# Altium project Group 2 Assignment 2.PrjPcb
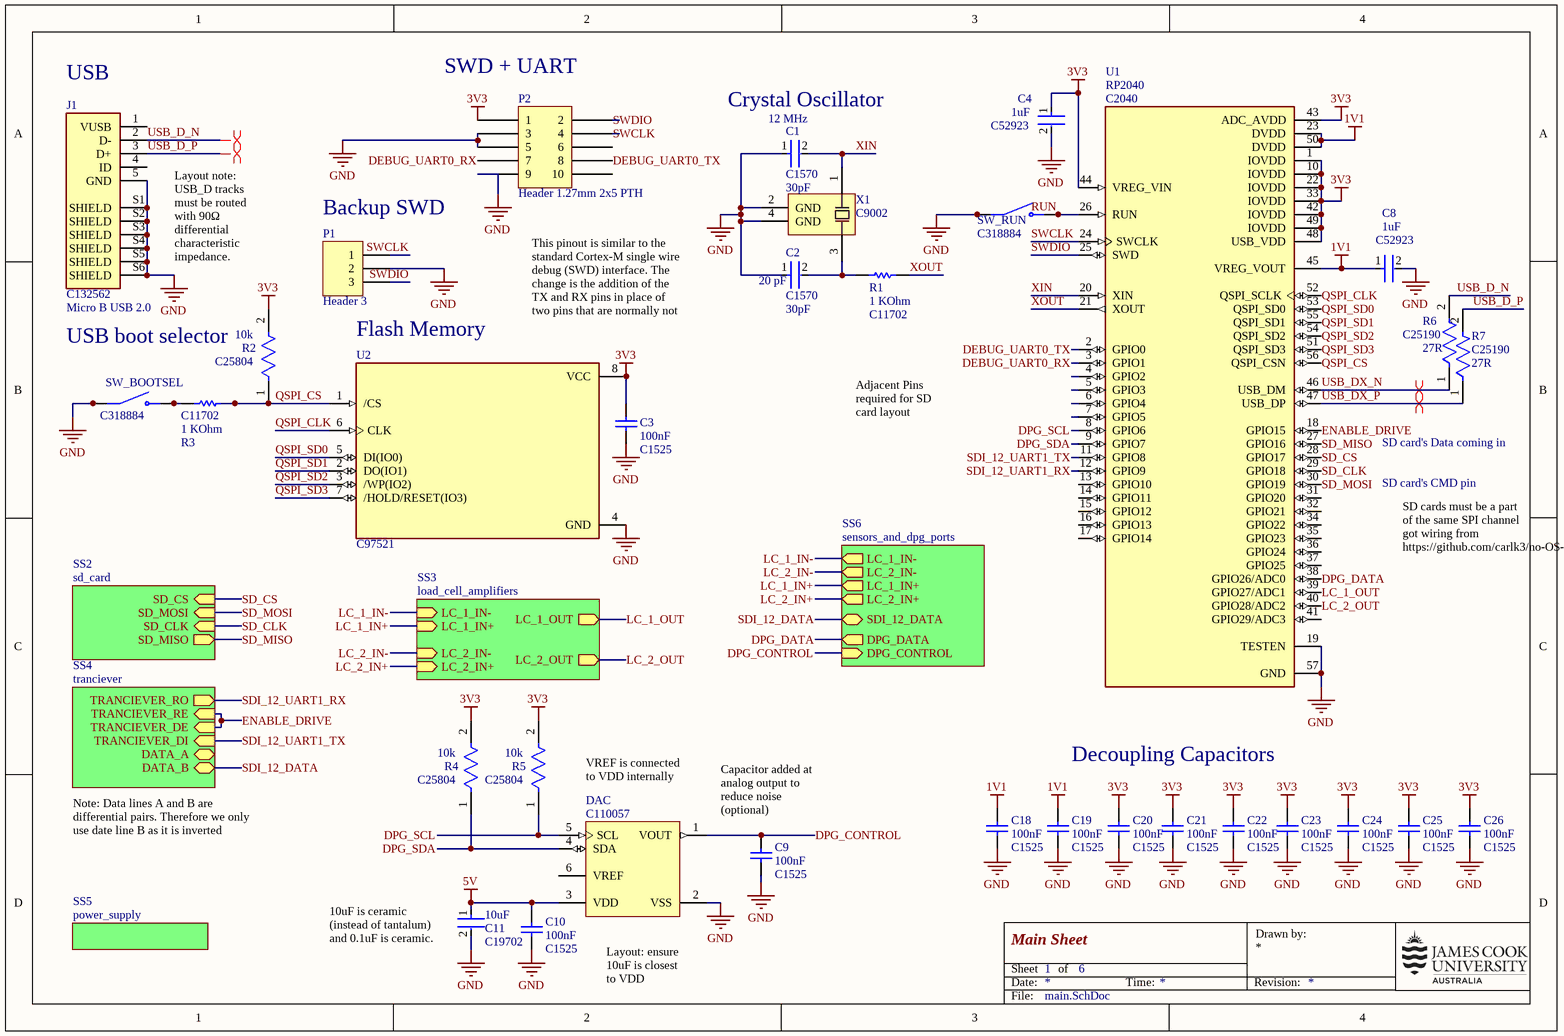
[diagram p0: main.SchDoc]
6 sheets, 73 parts. Net scope: hierarchical (ports join the sheet entries above them; power ports are global).
Board file: PCB.PcbDoc
Sheets:
  main.SchDoc
    SS2 = sd_card.SchDoc
    SS3 = load_cell_amplifiers.SchDoc
    SS4 = tranciever.SchDoc
    SS5 = power_supply.SchDoc
    SS6 = sensors_and_dpg_ports.SchDoc

## Sheet main.SchDoc: Main Sheet
size A4; SheetNumber: 1; SheetTotal: 6

### Parts
C1  JLCPCB Part: C1570  Capacitance: 30pF  [FP-0402-L_1_0_1-W_0_5_0_1-IPC_B]  (hidden comment: 0402CG300J500NT)
C2  JLCPCB Part: C1570  Capacitance: 30pF  [FP-0402-L_1_0_1-W_0_5_0_1-IPC_B]  (hidden comment: 0402CG300J500NT)
C3  JLCPCB Part: C1525  Capacitance: 100nF  [CAPC1050X55X23NL05T13]  (hidden comment: CL05B104KO5NNNC)
C4  Capacitance: 1uF  JLCPCB Part: C52923  [FP-CL542-IPC_B]  (hidden comment: CL05A105KA5NQNC)
C8  Capacitance: 1uF  JLCPCB Part: C52923  [FP-CL542-IPC_B]  (hidden comment: CL05A105KA5NQNC)
C9  JLCPCB Part: C1525  Capacitance: 100nF  [CAPC1050X55X23NL05T13]  (hidden comment: CL05B104KO5NNNC)
C10  JLCPCB Part: C1525  Capacitance: 100nF  [CAPC1050X55X23NL05T13]  (hidden comment: CL05B104KO5NNNC)
C11  JLCPCB Part: C19702  Capacitance: 10uF  [FP-CL10-IPC_B]  (hidden comment: CL10A106KP8NNNC)
C18  JLCPCB Part: C1525  Capacitance: 100nF  [CAPC1050X55X23NL05T13]  (hidden comment: CL05B104KO5NNNC)
C19  JLCPCB Part: C1525  Capacitance: 100nF  [CAPC1050X55X23NL05T13]  (hidden comment: CL05B104KO5NNNC)
C20  JLCPCB Part: C1525  Capacitance: 100nF  [CAPC1050X55X23NL05T13]  (hidden comment: CL05B104KO5NNNC)
C21  JLCPCB Part: C1525  Capacitance: 100nF  [CAPC1050X55X23NL05T13]  (hidden comment: CL05B104KO5NNNC)
C22  JLCPCB Part: C1525  Capacitance: 100nF  [CAPC1050X55X23NL05T13]  (hidden comment: CL05B104KO5NNNC)
C23  JLCPCB Part: C1525  Capacitance: 100nF  [CAPC1050X55X23NL05T13]  (hidden comment: CL05B104KO5NNNC)
C24  JLCPCB Part: C1525  Capacitance: 100nF  [CAPC1050X55X23NL05T13]  (hidden comment: CL05B104KO5NNNC)
C25  JLCPCB Part: C1525  Capacitance: 100nF  [CAPC1050X55X23NL05T13]  (hidden comment: CL05B104KO5NNNC)
C26  JLCPCB Part: C1525  Capacitance: 100nF  [CAPC1050X55X23NL05T13]  (hidden comment: CL05B104KO5NNNC)
DAC  JLCPCB Part: C110057  [SOT-23-CH6_M]  (hidden comment: MCP4716A0T-E/CH)
J1  Micro B USB 2.0  JLCPCB Part: C132562  [FCI_10118193-0001LF]
P1  Header 3  [HDR1X3]
P2  Header 1.27mm 2x5 PTH  [Header 1.27mm 2x5 PTH]
R1  JLCPCB Part: C11702  Resistance: 1 KOhm  [RESC1005X40X25NL05T05]  (hidden comment: 0402WGF1001TCE)
R2  JLCPCB Part: C25804  Resistance: 10k  [FP-CRCW0603-e3-IPC_B]  (hidden comment: 0603WAF1002T5E)
R3  JLCPCB Part: C11702  Resistance: 1 KOhm  [RESC1005X40X25NL05T05]  (hidden comment: 0402WGF1001TCE)
R4  JLCPCB Part: C25804  Resistance: 10k  [FP-CRCW0603-e3-IPC_B]  (hidden comment: 0603WAF1002T5E)
R5  JLCPCB Part: C25804  Resistance: 10k  [FP-CRCW0603-e3-IPC_B]  (hidden comment: 0603WAF1002T5E)
R6  JLCPCB Part: C25190  Resistance: 27R  [FP-CRCW0603-e3-IPC_B]  (hidden comment: 0603WAF270JT5E)
R7  JLCPCB Part: C25190  Resistance: 27R  [FP-CRCW0603-e3-IPC_B]  (hidden comment: 0603WAF270JT5E)
SW_BOOTSEL  JLCPCB Part: C318884  [SW_TS-1187A-B-A-B]  (hidden comment: TS-1187A-B-A-B)
SW_RUN  JLCPCB Part: C318884  [SW_TS-1187A-B-A-B]  (hidden comment: TS-1187A-B-A-B)
U1  RP2040  JLCPCB Part: C2040  [QFN40P700X700X90-57N]
U2  JLCPCB Part: C97521  [SOIC127P790X216-8N]  (hidden comment: W25Q128JVSIQ)
X1  Frequency: 12 MHz  JLCPCB Part: C9002  Load capacitance: 20 pF  [X322512MSB4SI-Footprint-1]  (hidden comment: X322512MSB4SI)

### Sub-sheets
SS2 = sd_card: SD_CS (in), SD_CLK (in), SD_MOSI (in), SD_MISO (out)
SS3 = load_cell_amplifiers: LC_1_IN- (in), LC_1_IN+ (in), LC_1_OUT (out), LC_2_IN- (in), LC_2_IN+ (in), LC_2_OUT (out)
SS4 = tranciever: TRANCIEVER_RO (out), TRANCIEVER_RE (in), TRANCIEVER_DE (in), TRANCIEVER_DI (in), DATA_A (bidir), DATA_B (bidir)
SS5 = power_supply: no entries
SS6 = sensors_and_dpg_ports: LC_1_IN- (out), LC_2_IN- (out), LC_2_IN+ (out), LC_1_IN+ (out), SDI_12_DATA (bidir), DPG_CONTROL (in), DPG_DATA (out)

### Nets
1V1: C8.1 C18.2 C19.2 U1.23(DVDD) U1.45(VREG_VOUT) U1.50(DVDD)
3V3: C3.2 C4.1 C20.2 C21.2 C22.2 C23.2 C24.2 C25.2 C26.2 P2.1 R2.2 R4.2 R5.2 U1.1(IOVDD) U1.10(IOVDD) U1.22(IOVDD) U1.33(IOVDD) U1.42(IOVDD) U1.43(ADC_AVDD) U1.44(VREG_VIN) U1.48(USB_VDD) U1.49(IOVDD) U2.8(VCC)
5V: C10.2 C11.1 DAC.3(VDD)
GND: C1.1 C2.1 C3.1 C4.2 C8.2 C9.1 C10.1 C11.2 C18.1 C19.1 C20.1 C21.1 C22.1 C23.1 C24.1 C25.1 C26.1 DAC.2(VSS) J1.5(GND) J1.S1(SHIELD) J1.S2(SHIELD) J1.S3(SHIELD) J1.S4(SHIELD) J1.S5(SHIELD) J1.S6(SHIELD) P1.2 P2.3 P2.5 P2.9 SW_BOOTSEL.A(COM) SW_BOOTSEL.B(COM) SW_RUN.A(COM) SW_RUN.B(COM) U1.19(TESTEN) U1.57(GND) U2.4(GND) X1.2(GND) X1.4(GND)
DEBUG_UART0_RX: P2.7 U1.3(GPIO1)
DEBUG_UART0_TX: P2.8 U1.2(GPIO0)
DPG_CONTROL: C9.2 DAC.1(VOUT) ; sheet SS6/DPG_CONTROL
DPG_DATA: U1.38(GPIO26/ADC0) ; sheet SS6/DPG_DATA
DPG_SCL: DAC.5(SCL) R5.1 U1.8(GPIO6)
DPG_SDA: DAC.4(SDA) R4.1 U1.9(GPIO7)
ENABLE_DRIVE: U1.18(GPIO15) ; sheet SS4/TRANCIEVER_RE, sheet SS4/TRANCIEVER_DE
LC_1_IN+: sheet SS3/LC_1_IN+, sheet SS6/LC_1_IN+
LC_1_IN-: sheet SS3/LC_1_IN-, sheet SS6/LC_1_IN-
LC_1_OUT: U1.39(GPIO27/ADC1) ; sheet SS3/LC_1_OUT
LC_2_IN+: sheet SS3/LC_2_IN+, sheet SS6/LC_2_IN+
LC_2_IN-: sheet SS3/LC_2_IN-, sheet SS6/LC_2_IN-
LC_2_OUT: U1.40(GPIO28/ADC2) ; sheet SS3/LC_2_OUT
QSPI_CLK: U1.52(QSPI_SCLK) U2.6(CLK)
QSPI_CS: R2.1 R3.2 U1.56(QSPI_CSN) U2.1(/CS)
QSPI_SD0: U1.53(QSPI_SD0) U2.5(DI(IO0))
QSPI_SD1: U1.55(QSPI_SD1) U2.2(DO(IO1))
QSPI_SD2: U1.54(QSPI_SD2) U2.3(/WP(IO2))
QSPI_SD3: U1.51(QSPI_SD3) U2.7(/HOLD/RESET(IO3))
RUN: SW_RUN.C(NO) SW_RUN.D(NO) U1.26(RUN)
SD_CLK: U1.29(GPIO18) ; sheet SS2/SD_CLK
SD_CS: U1.28(GPIO17) ; sheet SS2/SD_CS
SD_MISO: U1.27(GPIO16) ; sheet SS2/SD_MISO
SD_MOSI: U1.30(GPIO19) ; sheet SS2/SD_MOSI
SDI_12_DATA: sheet SS4/DATA_B, sheet SS6/SDI_12_DATA
SDI_12_UART1_RX: U1.12(GPIO9) ; sheet SS4/TRANCIEVER_RO
SDI_12_UART1_TX: U1.11(GPIO8) ; sheet SS4/TRANCIEVER_DI
SWCLK: P1.1 P2.4 U1.24(SWCLK)
SWDIO: P1.3 P2.2 U1.25(SWD)
USB_D_N: J1.2(D-) R6.2
USB_D_P: J1.3(D+) R7.2
USB_DX_N: R6.1 U1.46(USB_DM)
USB_DX_P: R7.1 U1.47(USB_DP)
XIN: C1.2 U1.20(XIN) X1.1(OSC1)
XOUT: R1.2 U1.21(XOUT)
NetC2_2: C2.2 R1.1 X1.3(OSC2)
NetR3_1: R3.1 SW_BOOTSEL.C(NO) SW_BOOTSEL.D(NO)

Not connected (* = marked no-connect by the designer): DAC 6(VREF); J1 1(VUSB) 4(ID); P2 6 10; U1 4(GPIO2) 5(GPIO3) 6(GPIO4) 7(GPIO5) 13(GPIO10) 14(GPIO11) 15(GPIO12) 16(GPIO13) 17(GPIO14) 31(GPIO20) 32(GPIO21) 34(GPIO22) 35(GPIO23) 36(GPIO24) 37(GPIO25) 41(GPIO29/ADC3)

### Layout directives
differential pair: USB_D_N, USB_D_P, USB_DX_N, USB_DX_P

### Notes on the sheet
- (near J1) USB
- (near P2) SWD + UART
- (near C1) Crystal Oscillator
- (near P1) Backup SWD
- Layout note: USB_D tracks must be routed with 90Ω differential characteristic impedance.
- This pinout is similar to the standard Cortex-M single wire debug (SWD) interface. The change is the addition of the TX and RX pins in place of two pins that are normally not connected.
- (near R2) USB boot selector
- Flash Memory
- Adjacent Pins required for SD card layout
- SD card's Data coming in
- SD card's CMD pin
- SD cards must be a part of the same SPI channel
  got wiring from https://github.com/carlk3/no-OS-FatFS-SD-SPI-RPi-Pico
- VREF is connected to VDD internally
- Decoupling Capacitors
- Note: Data lines A and B are differential pairs. Therefore we only use date line B as it is inverted
- Capacitor added at analog output to reduce noise (optional)
- (near C11) 10uF is ceramic (instead of tantalum) and 0.1uF is ceramic.
- (near DAC) Layout: ensure 10uF is closest to VDD
- Date:
- Sheet
- of
- Time:
- Revision:
- Drawn by:
- File:

### Library data of the parts
C1 C2 = CMP-006-0002-1: General Purpose Ceramic Capacitor, 0402, 30pF, 5%, C0G, 30ppm/°C, 50V; Insulation Resistance: 100GR; Height: 0.5mm; Dielectric: C0G; Max Operating Temperature: 125°C; Contact Plating: Tin; Thickness: 0.022inch; Lead Free: Lead Free; Case Code (Metric): 1005; Min Operating Temperature: -55°C; Termination: SMD/SMT; Number of Pins: 2; REACH SVHC: No SVHC; Length: 1mm; Tolerance: 5%; Depth: 0.5mm; Voltage: 50V; Width: 0.5mm; Radiation Hardening: No; Voltage Rating: 50V; Case Code (Imperial): 0402; Package Quantity: 1; Construction: Flat; Case/Package: 0402; Temperature Coefficient: 30ppm/°C; Mount: Surface Mount; Packaging: Tape and Reel; RoHS Compliant: Yes; Voltage Rating (DC): 50V; Series: -
C3 C9 C10 C18-C26 = CMP-00007-3: Chip Capacitor, 100 nF, +/- 10%, 16 V, -55 to 125 degC, 0402 (1005 Metric), RoHS, Tape and Reel; Manufacturer: Samsung Electro-Mechanics; Rated Voltage: 16V; Dielectric: X7R; Manufacturer URL: http://www.samsungsem.com/global/index.jsp; Datasheet Version: Nov-10; Case Size/Dimension: 0402; Tolerance (%): ±10%; Datasheet URL: https://datasheet.ciiva.com/29198/458718-da-01-en-vs-kondensator-0402-29198423.pdf
C4 C8 = CMP-00005-3: Cap Ceramic 1uF 25V X5R ±10% SMD 0402 +85°C Paper T/R; Height: 0.5mm; Thickness: 0.022inch; Radiation Hardening: No; Dielectric: X5R; Lead Free: Lead Free; Min Operating Temperature: -55°C; Mount: Surface Mount; Package Quantity: 10000; Case Code (Imperial): 0402; Voltage Rating: 25V; Case Code (Metric): 1005; Length: 1mm; Max Operating Temperature: 85°C; Case/Package: 0402; Tolerance: 10%; Packaging: Tape and Reel; Material: Ceramic; Depth: 0.5mm; Width: 0.02inch
C11 = CMP-00006-4: Cap Ceramic 10uF 10V X5R ±10% Pad SMD 0603 +85°C T/R; Case Code (Metric): 1608; Packaging: Tape and Reel; Case/Package: 0603; Voltage Rating: 10V; Mount: Surface Mount; Max Operating Temperature: 85°C; Width: 0.031inch; Length: 0.063inch; Case Code (Imperial): 0603; Thickness: 0.041inch; Tolerance: 10%; Min Operating Temperature: -55°C
DAC = CMP-0188-01210-1: 10-Bit Voltage Output Digital-to-Analog Converter with EEPROM and I2C Interface, 6-Pin SOT-23, Extended Temperature, Tape and Reel; Code_IPC: SOT26A-6; ComponentLink2Description: Datasheet; DatasheetVersion: revB, Sep-2011; PackageDescription: 6-Lead Plastic Small Outline Transistor (CH) [SOT-23]; ComponentLink2URL: http://ww1.microchip.com/downloads/en/DeviceDoc/22272B.pdf; ComponentLink1URL: http://www.microchip.com/; PackageReference: SOT-23-CH6; ComponentLink1Description: Manufacturer URL; ComponentLink3URL: http://www.microchip.com/stellent/groups/techpub_sg/documents/packagingspec/en012702.pdf; ComponentLink3Description: Package Specification; PackageVersion: revBB, Aug-2009
J1 = CMP-045-000000-8: USB - micro B USB 2.0 Receptacle Connector 5 Position Surface Mount, Right Angle; Through Hole; MF: Amphenol ICC; MP: 10118193-0001LF; Component Type: Standard; Design Item ID: 10118193-0001LF; Pin Count: 11; Package: None; Source: SnapEDAsch.SchLib; SnapEDA_Link: https://www.snapeda.com/parts/10118193-0001LF/Amphenol%20FCI/view-part/2758989/?ref=snap
P1 = CMP-002-00117-1: Header, 3-Pin; Signal Integrity: Connector; Design Item ID: Header 3; LatestRevisionDate: 17-Jul-2002; Publisher: Altium Limited; Component Type: Standard; Pin Count: 3; Source: Miscellaneous Connectors.SchLib; LatestRevisionNote: Re-released for DXP Platform.
P2 = CMP-005-0002-2: Header 1.27mm pitch, 2x5, PTH through hole; Pins: 10; element14 Item: 1577743; Design Item ID: Header 1.27mm 2x5 PTH; Source: JCULibrary.SchLib; Component Type: Standard
R1 R3 = CMP-009-0000-2: Chip Resistor, 1 KOhm, +/- 1%, 100 mW, -55 to 155 degC, 0402 (1005 Metric), RoHS, Tape and Reel; Manufacturer: Basic Passives; Voltage Rating: 50 V; Case\/Package: 0402; Power Rating: 100 mW; PackageDescription: 2-Pin Surface Mount Device, Body 1 x 0.5 mm; Max Operating Temperature: 155 degC; PackageReference: 0402; Mount: Surface Mount; Package Quantity: 10000; Pins: 2; Mounting Technology: Surface Mount; Tolerance: 1%; Width: 0.5 mm; Min Operating Temperature: -55 degC; Height: 0.35 mm; Packaging: Tape and Reel; Case Code (Metric): 1005; Case Code (Imperial): 0402; Radiation Hardening: No; PartNumber: 0402WGF1001TCE; Length: 1 mm; REACH SVHC: Yes; RoHSCompliant: true
R2 R4 R5 = CMP-009-0009-1: RES Thick Film, 10kΩ, 1%, 0.1W, 100ppm/°C, 0603; Voltage Rating: 75V; Power Rating: 100mW; Composition: Thick Film; Military Standard: Not; Temperature Coefficient: 100ppm/°C; Length: 1.55mm; Tolerance: 1%; Lead Free: Lead Free; Max Operating Temperature: 155°C; Number of Pins: 2; Width: 0.85mm; Termination: SMD/SMT; Packaging: Tape and Reel; Weight: 7.1E-05oz; Radiation Hardening: No; Voltage Rating (DC): 75V; Height: 0.45mm; Min Operating Temperature: -55°C; Mount: Surface Mount; Contact Plating: Tin; Case Code (Metric): 1608; Case Code (Imperial): 0603; Depth: 0.85mm; Case/Package: 0603; Package Quantity: 5000
R6 R7 = CMP-00004-5: RES Thick Film, 27Ω, 1%, 0.1W, 200ppm/°C, 0603; Voltage Rating (DC): 75V; Temperature Coefficient: 100ppm/°C; Power Rating: 100mW; Height: 0.45mm; Contact Plating: Tin; Radiation Hardening: No; Case/Package: 0603; Mount: Surface Mount; Max Operating Temperature: 155°C; Packaging: Tape and Reel; Length: 1.55mm; Tolerance: 1%; Package Quantity: 5000; Termination: SMD/SMT; Number of Pins: 2; Depth: 0.85mm; Case Code (Metric): 1608; Case Code (Imperial): 0603; Width: 0.85mm; Military Standard: Not; Min Operating Temperature: -55°C; Lead Free: Lead Free; Composition: Thick Film; Weight: 7.1E-05oz; Voltage Rating: 75V
SW_BOOTSEL SW_RUN = CMP-051-000000-5: SPST 50mA @ 12VDC Top Actuated Round Button 160gf SMD Tactile Switches RoHS; Value: *; Pin Count: 4; MP: TS-1187A-B-A-B; Price: None; Availability: Unavailable; Design Item ID: TS-1187A-B-A-B; Package: None; Component Type: Standard; Source: TS-1187A-B-A-B.SchLib
U1 = CMP-043-000000-5: ARM Cortex-M0+ MCU 32-Bit Microcontroller for Raspberry Pi Pico; Package: None; Price: None; Availability: Available; Design Item ID: RP2040; Component Type: Standard; Pin Count: 57; Source: RP2040.SchLib; Value: *; MP: RP2040
U2 = CMP-031-00006-4: FLASH - NOR Memory IC 128Mb (16M x 8) SPI - Quad I/O, QPI, DTR 133 MHz 8-SOIC; MF: Winbond Electronics; Pin Count: 8; Check_prices: https://www.snapeda.com/parts/W25Q128JVSIQ/Winbond+Electronics/view-part/?ref=eda; Package: SOIC-8 Winbond; MP: W25Q128JVSIQ; Component Type: Standard; Source: W25Q128JVSIQ.SchLib; Design Item ID: W25Q128JVSIQ; Purchase-URL: https://pricing.snapeda.com/search/part/W25Q128JVSIQ/?ref=eda; Price: None; Availability: In Stock; SnapEDA_Link: https://www.snapeda.com/parts/W25Q128JVSIQ/Winbond+Electronics/view-part/?ref=snap; Value: *
X1 = CMP-00002-4: 12MHz SMD Crystal Resonator 20pF ±10ppm ±30ppm -40℃~+85℃ SMD3225-4P  Crystals ROHS Yangxing Tech; Max ESR: 80 Ω

## Sheet sd_card.SchDoc: SD Card Reader Header
size A4; DrawnBy: Hunter Kruger-Ilingworth; SheetNumber: 2; SheetTotal: 6
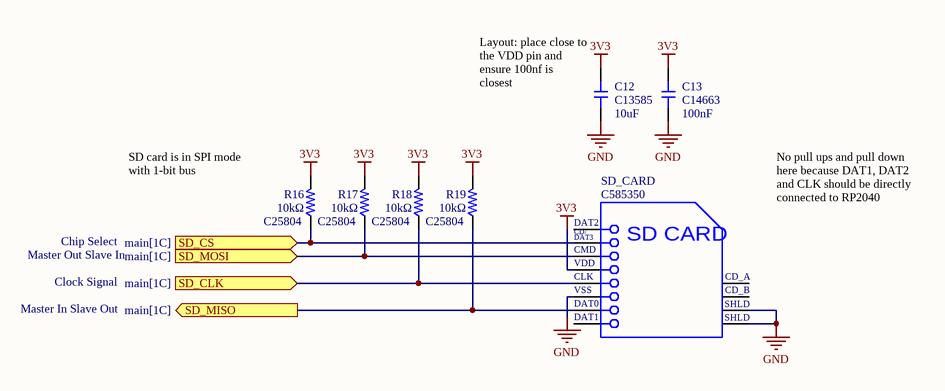
[diagram p1: sd_card.SchDoc]

### Parts
C12  Capacitance: 10uF  JLCPCB Part: C13585  [CAP-1206]  (hidden comment: CL31A106KBHNNNE)
C13  Capacitance: 100nF  JLCPCB Part: C14663  [CAP-0603]  (hidden comment: CC0603KRX7R9BB104)
R16  Resistance: 10kΩ  JLCPCB Part: C25804  [RES-0603]  (hidden comment: 0603WAF1002T5E)
R17  Resistance: 10kΩ  JLCPCB Part: C25804  [RES-0603]  (hidden comment: 0603WAF1002T5E)
R18  Resistance: 10kΩ  JLCPCB Part: C25804  [RES-0603]  (hidden comment: 0603WAF1002T5E)
R19  Resistance: 10kΩ  JLCPCB Part: C25804  [RES-0603]  (hidden comment: 0603WAF1002T5E)
SD_CARD  JLCPCB Part: C585350  [MOLX-104031-0811_V]  (hidden comment: 104031-0811)

### Ports
SD_CLK (in, see main[1C]), SD_CS (in, see main[1C]), SD_MISO (out, see main[1C]), SD_MOSI (in, see main[1C])

### Nets
3V3: C12.2 C13.2 R16.2 R17.2 R18.2 R19.2 SD_CARD.4(VDD)
GND: C12.1 C13.1 SD_CARD.6(VSS2) SD_CARD.11(SHLD1) SD_CARD.12(SHLD2)
SD_CLK: R18.1 SD_CARD.5(CLK) ; port SD_CLK
SD_CS: R16.1 SD_CARD.2(CMD) ; port SD_CS
SD_MISO: R19.1 SD_CARD.7(DAT0) ; port SD_MISO
SD_MOSI: R17.1 SD_CARD.3(VSS1) ; port SD_MOSI

Not connected (* = marked no-connect by the designer): SD_CARD 1(CD/DAT3) 8(DAT1) 9(CD_A) 10(CD_B)

### Notes on the sheet
- (near C12) Layout: place close to the VDD pin and ensure 100nf is closest
- (near R16) SD card is in SPI mode with 1-bit bus
- No pull ups and pull down here because DAT1, DAT2 and CLK should be directly connected to RP2040
- Master Out Slave In
- Clock Signal
- Chip Select
- Master In Slave Out
- Date:
- Sheet
- of
- Time:
- Revision:
- Drawn by:
- File:
- (in symbol CMP-2000-05825-1) DAT2; CD/; DAT3; SD CARD; VSS; SHLD

### Library data of the parts
C12 = CMP-001-00157-1: Capacitor, Ceramic (MLCC), 10uF, ±10%, 50V, X5R, ±10%, SMD 1206; Manufacturer: Samsung Electro-Mechanics; Package Size: 1206; Manufacturer Part Number: CL31A106KBHNNNE; JLCPCB Basic Part: Yes; Design Item ID: CL31A106KBHNNNE; ComponentLink2Description: JLCPCB Part URL; RoHS: Yes; ComponentLink1Description: Datasheet; ComponentLink3URL: https://lcsc.com/product-detail/Multilayer-Ceramic-Capacitors-MLCC---SMD-SMT_Samsung-Electro-Mechanics-Samsung-Electro-Mechanics-CL31A106KBHNNNE_C13585.html; ComponentLink3Description: LCSC Part URL; Tolerance: ±10%; Category: Capacitors - MLCC; Temperature Coefficient: X5R; JLCPCB Part Number: C13585; Voltage Rating: 50V; ComponentLink2URL: https://jlcpcb.com/partdetail/C13585; Source: jlcpcb_capacitors_basic.schlib; ComponentLink1URL: https://datasheet.lcsc.com/lcsc/1810221112_Samsung-Electro-Mechanics-CL31A106KBHNNNE_C13585.pdf
C13 = CMP-001-00167-1: Capacitor, Ceramic (MLCC), 100nF, ±10%, 50V, X7R, ±10%, SMD 0603; Manufacturer: YAGEO; ComponentLink1Description: Datasheet; Package Size: 0603; JLCPCB Part Number: C14663; Temperature Coefficient: X7R; JLCPCB Basic Part: Yes; RoHS: Yes; Source: jlcpcb_capacitors_basic.schlib; ComponentLink3URL: https://lcsc.com/product-detail/Multilayer-Ceramic-Capacitors-MLCC---SMD-SMT_YAGEO-YAGEO-CC0603KRX7R9BB104_C14663.html; Design Item ID: CC0603KRX7R9BB104; ComponentLink1URL: https://datasheet.lcsc.com/lcsc/1809301912_YAGEO-CC0603KRX7R9BB104_C14663.pdf; ComponentLink3Description: LCSC Part URL; Voltage Rating: 50V; ComponentLink2Description: JLCPCB Part URL; Category: Capacitors - MLCC; Tolerance: ±10%; Manufacturer Part Number: CC0603KRX7R9BB104; ComponentLink2URL: https://jlcpcb.com/partdetail/C14663
R16-R19 = CMP-009-00072-1: Resistor, 10kΩ, ±1%, 100mW, 75V, ±100ppm/℃, -55℃~+155℃, SMD 0603; Manufacturer: Uniroyal; Source: jlcpcb_resistors_basic.schlib; ComponentLink2Description: JLCPCB Part URL; ComponentLink1URL: https://datasheet.lcsc.com/lcsc/2206010045_UNI-ROYAL-Uniroyal-Elec-0603WAF1002T5E_C25804.pdf; ComponentLink2URL: https://jlcpcb.com/partdetail/C25804; Temperature Coefficient: ±100ppm/℃; Manufacturer Part Number: 0603WAF1002T5E; Power Rating: 100mW; ComponentLink1Description: Datasheet; Design Item ID: 0603WAF1002T5E; Category: Resistors; Tolerance: ±1%; Package Size: 0603; JLCPCB Basic Part: Yes; Temperature Rating: -55℃~+155℃; Voltage Rating: 75V
SD_CARD = CMP-2000-05825-1: Micro SD Card, RA, -25 to 85 degC, 8-Pin SMD, RoHS, Tape and Reel; Voltage Rating: 10VAC/DC; Number of Contacts: 8; Insertion - Extraction Style: Push-Pull; Pitch: 1.1mm; Mating Cycles: 10000; Brand: Molex; Current Rating: 500mA; Manufacturer URL: http://www.molex.com/; Card Type: microSD; Mounting Type: Standard; Height: 1.42mm; Mounting Technology: SurfaceMount; Contact Plating: Gold; Product Category: MemoryCardConnectors; Package Description: 8-Pin Surface Mount Device, Body 11.95 x 11.4 mm, Pitch 1.1 mm; Datasheet URL: http://www.molex.com/pdm_docs/sd/1040310811_sd.pdf; Termination Style: SMD; Length: 11.4mm; Housing Material: LiquidCrystalPolymer(LCP); Orientation: RightAngle; RoHS: True; Contact Material: PhosphorBronze; Datasheet Version: Rev. E, 04/2006; Packaging: Reel; Manufacturer: Molex; Series: 104031; Product: CardConnectors; Number of Rows: 1Row; Package Reference: 104031-0811

## Sheet load_cell_amplifiers.SchDoc: Load Cell Amplifier Circuitry
size A4; DrawnBy: Hunter Kruger-Ilingworth; SheetNumber: 6; SheetTotal: 6
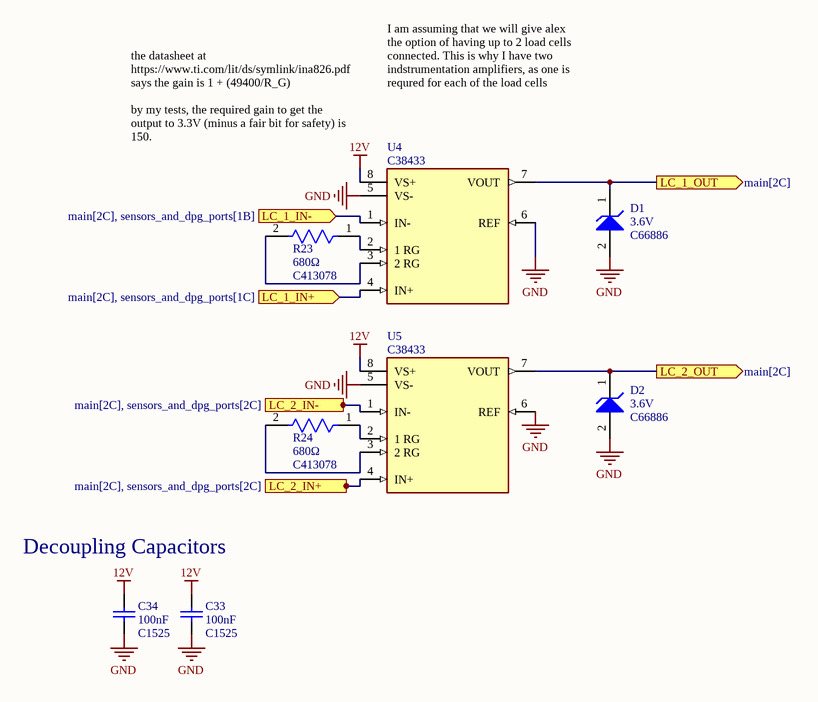
[diagram p2: load_cell_amplifiers.SchDoc]

### Parts
C33  JLCPCB Part: C1525  Capacitance: 100nF  [CAPC1050X55X23NL05T13]  (hidden comment: CL05B104KO5NNNC)
C34  JLCPCB Part: C1525  Capacitance: 100nF  [CAPC1050X55X23NL05T13]  (hidden comment: CL05B104KO5NNNC)
D1  VZ Typ (V): 3.6V  JLCPCB Part: C66886  [ONSC-SOD-123-2-425-04_V]  (hidden comment: MMSZ4685T1G)
D2  VZ Typ (V): 3.6V  JLCPCB Part: C66886  [ONSC-SOD-123-2-425-04_V]  (hidden comment: MMSZ4685T1G)
R23  Resistance: 680Ω  JLCPCB Part: C413078  [FP-ERJ2RK-MFG]  (hidden comment: ERJ-2RKF6800X)
R24  Resistance: 680Ω  JLCPCB Part: C413078  [FP-ERJ2RK-MFG]  (hidden comment: ERJ-2RKF6800X)
U4  JLCPCB Part: C38433  [FP-D0008A-IPC_A]  (hidden comment: INA826AIDR)
U5  JLCPCB Part: C38433  [FP-D0008A-IPC_A]  (hidden comment: INA826AIDR)

### Ports
LC_1_IN+ (in, see main[2C], sensors_and_dpg_ports[1C]), LC_1_IN- (in, see main[2C], sensors_and_dpg_ports[1B]), LC_1_OUT (out, see main[2C]), LC_2_IN+ (in, see main[2C], sensors_and_dpg_ports[2C]), LC_2_IN- (in, see main[2C], sensors_and_dpg_ports[2C]), LC_2_OUT (out, see main[2C])

### Nets
12V: C33.2 C34.2 U4.8(VS+) U5.8(VS+)
GND: C33.1 C34.1 D1.2(A) D2.2(A) U4.5(VS-) U4.6(REF) U5.5(VS-) U5.6(REF)
LC_1_IN+: U4.4(IN+) ; port LC_1_IN+
LC_1_IN-: U4.1(IN-) ; port LC_1_IN-
LC_1_OUT: D1.1(K) U4.7(VOUT) ; port LC_1_OUT
LC_2_IN+: U5.4(IN+) ; port LC_2_IN+
LC_2_IN-: U5.1(IN-) ; port LC_2_IN-
LC_2_OUT: D2.1(K) U5.7(VOUT) ; port LC_2_OUT
NetR23_1: R23.1 U4.2(1_RG)
NetR23_2: R23.2 U4.3(2_RG)
NetR24_1: R24.1 U5.2(1_RG)
NetR24_2: R24.2 U5.3(2_RG)

### Notes on the sheet
- I am assuming that we will give alex the option of having up to 2 load cells connected. This is why I have two indstrumentation amplifiers, as one is requred for each of the load cells
- (near U4) the datasheet at https://www.ti.com/lit/ds/symlink/ina826.pdf
  says the gain is 1 + (49400/R_G)
  by my tests, the required gain to get the output to 3.3V (minus a fair bit for safety) is 150.
- Decoupling Capacitors
- Date:
- Sheet
- of
- Time:
- Revision:
- Drawn by:
- File:

### Library data of the parts
C33 C34 = CMP-00007-3: as C3 on sheet main; Manufacturer URL: http://www.samsungsem.com/global/index.jsp; Datasheet Version: Nov-10; Case Size/Dimension: 0402; Tolerance (%): ±10%; Datasheet URL: https://datasheet.ciiva.com/29198/458718-da-01-en-vs-kondensator-0402-29198423.pdf
D1 D2 = CMP-1060-00574-1: Zener Voltage Regulator, 500 mW, 2-Pin SOD-123, Pb-Free, Tape and Reel; Manufacturer: On Semiconductor; P Max (W): 0.5; DatasheetVersion: Rev. 9; ComponentLink2Description: Datasheet; Mounting Technology: Surface Mount; ComponentLink3URL: http://www.onsemi.com/pub_link/Collateral/425-04.PDF; ComponentLink3Description: Package Specification; RoHS: Pb-Free; PartNumber: MMSZ4685T1G; ComponentLink1URL: http://www.onsemi.com/; PackageDescription: 2-Pin SOD, Body 1.6 x 2.69 mm; ComponentLink2URL: http://www.onsemi.com/pub_link/Collateral/MMSZ4678T1-D.PDF; ComponentLink1Description: Manufacturer URL; Packing: Tape and Reel; PackageVersion: Rev. G, 10/2009; PackageReference: SOD-123-2-425-04
R23 R24 = CMP-2002-01166-2: NexarPartId: 12588708; Power Rating: 100mW; Voltage Rating: 50V; Temperature Coefficient: 100ppm/°C; Tolerance: 1%; Width: 508µm; Case/Package: 0402; Termination: SMD/SMT; Depth: 500µm; Min Operating Temperature: -55°C; REACH SVHC: No SVHC; Contact Plating: Tin; Max Power Dissipation: 100mW; Number of Terminations: 2; RoHS: Compliant; Length: 1mm; Case Code (Metric): 1005; Schedule B: 8533210045, 8533210045; Mount: Surface Mount; Features: Automotive AEC-Q200; Number of Pins: 2; Height: 350µm; Radiation Hardening: No; Packaging: Cut Tape; Voltage Rating (DC): 50V; Lifecycle Status: Production; Case Code (Imperial): 0402; Lead Free: Lead Free; Composition: Thick Film; Max Operating Temperature: 155°C
U4 U5 = CMP-0944-00042-3: IC INST AMP 1 CIRCUIT 8SOIC; Number of Circuits: 1; Common Mode Rejection Ratio: 84dB; Power Supply Rejection Ratio (PSRR): 100dB; Input Voltage Noise Density: 18nV/sqrt Hz; Input Resistance: 100kR; Output Current per Channel: 16mA; Input Offset Voltage (Vos): 150uV; Bandwidth: 1MHz; Supply Current: 200uA; Input Bias Current: 65nA; Max Dual Supply Voltage: 18V; Max Supply Voltage: 36V; Min Supply Voltage: 2.7V; Voltage Gain: 60dB; Slew Rate: 1V/µs; Min Dual Supply Voltage: 1.35V; Number of Elements: 1; Series: -; Number of Pins: 8; Lead Free: Lead Free; Output Current: 16mA; REACH SVHC: No SVHC; Min Operating Temperature: -40°C; Quiescent Current: 200uA; Nominal Supply Current: 200uA; Max Operating Temperature: 125°C; RoHS Compliant: Yes; Case/Package: D; -3db Bandwidth: 1MHz; Radiation Hardening: No; Operating Supply Current: 200uA; Packaging: Tape and Reel; Package Quantity: 1; Number of Amplifiers: 1; Number of Channels: 1; JLC Part Number: C38433

## Sheet tranciever.SchDoc: Tranciever Circuit
size A4; DrawnBy: Thomas Mehes; SheetNumber: 3; SheetTotal: 6
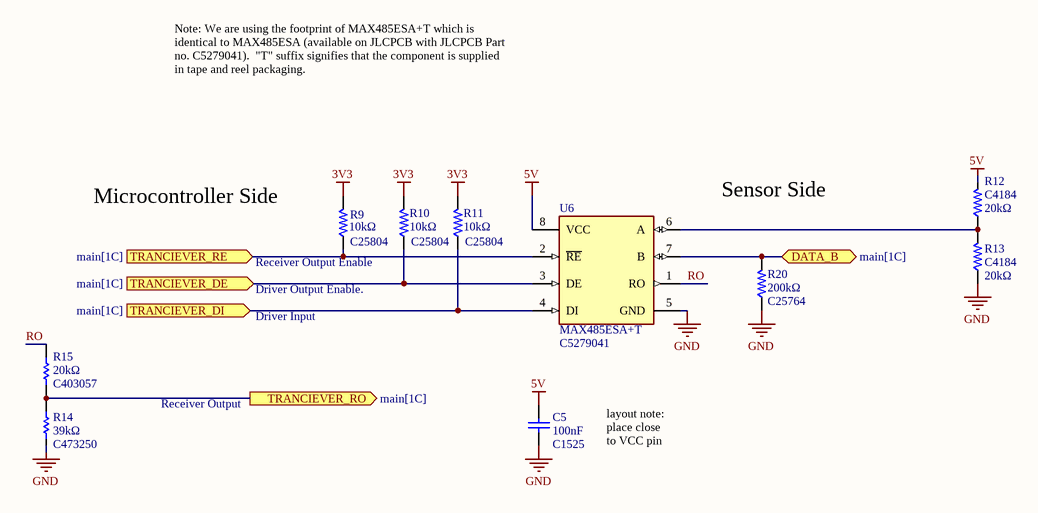
[diagram p3: tranciever.SchDoc]

### Parts
C5  JLCPCB Part: C1525  Capacitance: 100nF  [CAPC1050X55X23NL05T13]  (hidden comment: CL05B104KO5NNNC)
R9  Resistance: 10kΩ  JLCPCB Part: C25804  [RES-0603]  (hidden comment: 0603WAF1002T5E)
R10  Resistance: 10kΩ  JLCPCB Part: C25804  [RES-0603]  (hidden comment: 0603WAF1002T5E)
R11  Resistance: 10kΩ  JLCPCB Part: C25804  [RES-0603]  (hidden comment: 0603WAF1002T5E)
R12  Resistance: 20kΩ  JLCPCB Part: C4184  [RES-0603]  (hidden comment: 0603WAF2002T5E)
R13  Resistance: 20kΩ  JLCPCB Part: C4184  [RES-0603]  (hidden comment: 0603WAF2002T5E)
R14  JLCPCB Part: C473250  Resistance: 39kΩ  [RESC1608X55X30LL20T20]  (hidden comment: ERA-3AEB393V)
R15  Resistance: 20kΩ  JLCPCB Part: C403057  [RESC1608X55X30ML15T15]  (hidden comment: ERJ-3EKF2002V)
R20  Resistance: 200kΩ  JLCPCB Part: C25764  [RES-0402]  (hidden comment: 0402WGF2003TCE)
U6  MAX485ESA+T  JLCPCB Part: C5279041  [FP-S8-2-MFG]

### Ports
DATA_B (bidir, see main[1C]), TRANCIEVER_DE (in, see main[1C]), TRANCIEVER_DI (in, see main[1C]), TRANCIEVER_RE (in, see main[1C]), TRANCIEVER_RO (out, see main[1C])

### Nets
3V3: R9.2 R10.2 R11.2
5V: C5.2 R12.2 U6.8(VCC)
GND: C5.1 R13.1 R14.1 R20.1 U6.5(GND)
ENABLE_DRIVE: R9.1 R10.1 U6.2(~{RE}) U6.3(DE) ; port TRANCIEVER_RE, port TRANCIEVER_DE
RO: R15.2 U6.1(RO)
SDI_12_DATA: R20.2 U6.7(B) ; port DATA_B
SDI_12_UART1_RX: R14.2 R15.1 ; port TRANCIEVER_RO
SDI_12_UART1_TX: R11.1 U6.4(DI) ; port TRANCIEVER_DI
NetR12_1: R12.1 R13.2 U6.6(A)

### Notes on the sheet
- Note: We are using the footprint of MAX485ESA+T which is identical to MAX485ESA (available on JLCPCB with JLCPCB Part no. C5279041).  "T" suffix signifies that the component is supplied in tape and reel packaging.
- Sensor Side
- Microcontroller Side
- Receiver Output Enable
- Driver Output Enable.
- Driver Input
- Receiver Output
- layout note: place close to VCC pin
- Date:
- Sheet
- of
- Time:
- Revision:
- Drawn by:
- File:

### Library data of the parts
C5 = CMP-00007-3: as C3 on sheet main; Manufacturer URL: http://www.samsungsem.com/global/index.jsp; Datasheet Version: Nov-10; Case Size/Dimension: 0402; Tolerance (%): ±10%; Datasheet URL: https://datasheet.ciiva.com/29198/458718-da-01-en-vs-kondensator-0402-29198423.pdf
R9-R11 = CMP-009-00072-1: as R16 on sheet sd_card; Source: jlcpcb_resistors_basic.schlib; ComponentLink2Description: JLCPCB Part URL; ComponentLink1URL: https://datasheet.lcsc.com/lcsc/2206010045_UNI-ROYAL-Uniroyal-Elec-0603WAF1002T5E_C25804.pdf; ComponentLink2URL: https://jlcpcb.com/partdetail/C25804; Temperature Coefficient: ±100ppm/℃; Manufacturer Part Number: 0603WAF1002T5E; Power Rating: 100mW; ComponentLink1Description: Datasheet; Design Item ID: 0603WAF1002T5E; Category: Resistors; Tolerance: ±1%; Package Size: 0603; JLCPCB Basic Part: Yes; Temperature Rating: -55℃~+155℃; Voltage Rating: 75V
R12 R13 = CMP-009-00100-1: Resistor, 20kΩ, ±1%, 100mW, 75V, ±100ppm/℃, -55℃~+155℃, SMD 0603; Manufacturer: Uniroyal; Temperature Rating: -55℃~+155℃; Tolerance: ±1%; Package Size: 0603; Category: Resistors; ComponentLink2Description: JLCPCB Part URL; ComponentLink2URL: https://jlcpcb.com/partdetail/C4184; ComponentLink1Description: Datasheet; Source: jlcpcb_resistors_basic.schlib; Manufacturer Part Number: 0603WAF2002T5E; ComponentLink1URL: https://datasheet.lcsc.com/lcsc/2206010230_UNI-ROYAL-Uniroyal-Elec-0603WAF2002T5E_C4184.pdf; JLCPCB Basic Part: Yes; Power Rating: 100mW; Temperature Coefficient: ±100ppm/℃; Voltage Rating: 75V; Design Item ID: 0603WAF2002T5E
  R12: JLCPCB Part Number: C4184
R14 = CMP-2000-00055-1: Manufacturer: Panasonic; Part Number: ERA-3AEB393V
R15 = CMP-2000-00318-1: Manufacturer: Panasonic; Part Number: ERJ-3EKF2002V
R20 = CMP-009-00025-1: Resistor, 200kΩ, ±1%, 62.5mW, 50V, ±100ppm/℃, -55℃~+155℃, SMD 0402; Manufacturer: Uniroyal; Tolerance: ±1%; JLCPCB Basic Part: Yes; Source: jlcpcb_resistors_basic.schlib; ComponentLink2Description: JLCPCB Part URL; Temperature Rating: -55℃~+155℃; ComponentLink1URL: https://datasheet.lcsc.com/lcsc/2206010100_UNI-ROYAL-Uniroyal-Elec-0402WGF2003TCE_C25764.pdf; ComponentLink2URL: https://jlcpcb.com/partdetail/C25764; Voltage Rating: 50V; Package Size: 0402; Power Rating: 62.5mW; Design Item ID: 0402WGF2003TCE; Manufacturer Part Number: 0402WGF2003TCE; Temperature Coefficient: ±100ppm/℃; ComponentLink1Description: Datasheet; Category: Resistors
U6 = CMP-05679-000009-1: IC TRANSCEIVER HALF 1/1 8SOIC; Manufacturer: Maxim Integrated; Min Supply Voltage: 4.75V; Nominal Supply Current: 0.5mA; Number Of Transmitters: 1; Data Rate: 2.5Mbits/s; Interface: RS-485,RS-422; Standoff Height: 0.1mm; Max Supply Voltage: 5.25V; Simplex Duplex: Half-Duplex; Package: S8-2; Temperature: -40°C to +85°C; Device Class L1: Integrated Circuits (ICs); Footprint Url: https://pdfserv.maximintegrated.com/land_patterns/90-0096.PDF; ComponentLink2URL: https://datasheets.maximintegrated.com/en/ds/MAX1487-MAX491.pdf; Height: 1.75mm; Mouser Description: RS-422/RS-485 Interface IC RS-485/RS-422 Transceiver; Octopart: https://octopart.com/max485esa%2Bt-maxim+integrated-40011239; RoHS: TRUE; ComponentLink2Description: Datasheet; Temperature Range Low: -40°C; Number Of Receivers: 1; Manufacturer Part Number: MAX485ESA+T; Ipc Land Pattern Name: SOIC127P600X155-8; Device Class L3: RS-232 / RS-422 / RS-485 Interface ICs; Automotive: No; Digikey Description: IC TRANSCEIVER HALF 1/1 8SOIC; Temperature Range High: +85°C; Category: IC; Device Class L2: Interface ICs; Lead Free: Yes

## Sheet power_supply.SchDoc: Power Circuitry
size A4; DrawnBy: Quentin Bouet; SheetNumber: 4; SheetTotal: 6
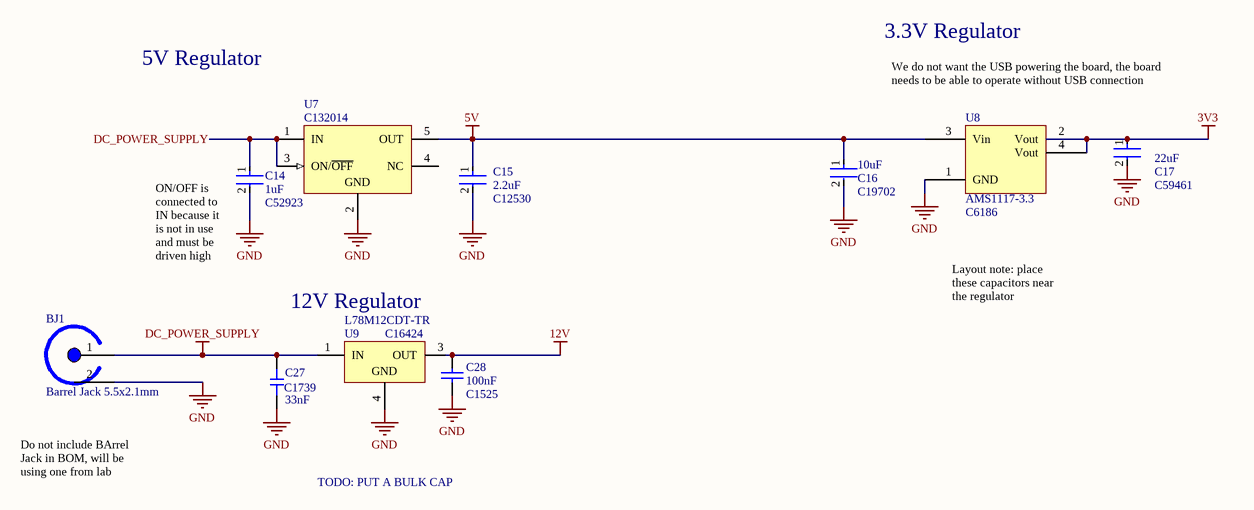
[diagram p4: power_supply.SchDoc]

### Parts
BJ1  Barrel Jack 5.5x2.1mm  [Barrel Jack 2.1x5.5mm THT]
C14  Capacitance: 1uF  JLCPCB Part: C52923  [FP-CL542-IPC_B]  (hidden comment: CL05A105KA5NQNC)
C15  Capacitance: 2.2uF  JLCPCB Part: C12530  [FP-CL50-IPC_C]  (hidden comment: CL05A225MQ5NSNC)
C16  JLCPCB Part: C19702  Capacitance: 10uF  [FP-CL10-IPC_B]  (hidden comment: CL10A106KP8NNNC)
C17  JLCPCB Part: C59461  Capacitance: 22uF  [FP-CL10-IPC_B]  (hidden comment: CL10A226MQ8NRNC)
C27  Capacitance: 33nF  JLCPCB Part: C1739  [CAP-0805]  (hidden comment: 0805B333K500NT)
C28  JLCPCB Part: C1525  Capacitance: 100nF  [CAPC1050X55X23NL05T13]  (hidden comment: CL05B104KO5NNNC)
U7  JLCPCB Part: C132014  [MF05A_M]  (hidden comment: LP2980AIM5-5.0/NOPB)
U8  AMS1117-3.3  JLCPCB Part: C6186  [SOT230P700X180-4N]
U9  L78M12CDT-TR  JLCPCB Part: C16424  [TO-252_L]

### Nets
3V3: C17.1 U8.2(Vout) U8.4(Vout)
5V: C15.1 C16.1 U7.5(OUT) U8.3(Vin)
12V: C28.2 U9.3(OUT)
DC_POWER_SUPPLY: BJ1.1(TIP) C14.1 C27.2 U7.1(IN) U7.3(ON/~{OFF}) U9.1(IN)
GND: BJ1.2(SLEEVE) C14.2 C15.2 C16.2 C17.2 C27.1 C28.1 U7.2(GND) U8.1(GND) U9.4(GND)

Not connected (* = marked no-connect by the designer): U7 4(NC)

### Notes on the sheet
- 5V Regulator
- 3.3V Regulator
- We do not want the USB powering the board, the board needs to be able to operate without USB connection
- (near C14) ON/OFF is connected to IN because it is not in use and must be driven high
- 12V Regulator
- Layout note: place these capacitors near the regulator
- Do not include BArrel Jack in BOM, will be using one from lab
- TODO: PUT A BULK CAP
- Date:
- Sheet
- of
- Time:
- Revision:
- Drawn by:
- File:

### Library data of the parts
BJ1 = CMP-005-0005-1: GCT DCJ200-10-A-K1-K; Pins: 2; Component Type: Standard; Design Item ID: Barrel Jack 5.5x2.1mm; Source: JCULibrary.SchLib; JLCPCB Part: jlcpcb part no.
C14 = CMP-00005-3: as C4 on sheet main; Height: 0.5mm; Thickness: 0.022inch; Radiation Hardening: No; Dielectric: X5R; Lead Free: Lead Free; Min Operating Temperature: -55°C; Mount: Surface Mount; Package Quantity: 10000; Case Code (Imperial): 0402; Voltage Rating: 25V; Case Code (Metric): 1005; Length: 1mm; Max Operating Temperature: 85°C; Case/Package: 0402; Tolerance: 10%; Packaging: Tape and Reel; Material: Ceramic; Depth: 0.5mm; Width: 0.02inch
C15 = CMP-13271-001039-1: Cap Ceramic 2.2uF 6.3V X5R ±20% SMD 0402 +85°C Paper T/R; Length: 1mm; Height: 0.5mm; Tolerance: 20%; Case/Package: 0402; Width: 0.02inch; Mount: Surface Mount; Case Code (Imperial): 0402; Case Code (Metric): 1005; Depth: 0.5mm; Lead Free: Lead Free; Package Quantity: 10000; Min Operating Temperature: -55°C; Max Operating Temperature: 85°C; Dielectric: X5R; Voltage Rating: 6.3V; Thickness: 0.022inch; Radiation Hardening: No; Packaging: Tape and Reel
C16 = CMP-00006-4: as C11 on sheet main; Case Code (Metric): 1608; Packaging: Tape and Reel; Case/Package: 0603; Voltage Rating: 10V; Mount: Surface Mount; Max Operating Temperature: 85°C; Width: 0.031inch; Length: 0.063inch; Case Code (Imperial): 0603; Thickness: 0.041inch; Tolerance: 10%; Min Operating Temperature: -55°C
C17 = CMP-006-0003-1: Cap Ceramic 22uF 6.3V X5R ±20% Pad SMD 0603; Thickness: 0.039inch; Length: 1.6mm; Case Code (Imperial): 0603; Voltage Rating: 6.3V; Mount: Surface Mount; Min Operating Temperature: -55°C; Case Code (Metric): 1608; Packaging: Tape and Reel; Max Operating Temperature: 85°C; Case/Package: 0603; Width: 0.031inch; Tolerance: 20%
C27 = CMP-001-00028-1: Capacitor, Ceramic (MLCC), 33nF, ±10%, 50V, X7R, ±10%, SMD 0805; Manufacturer: FH(Guangdong Fenghua Advanced Tech); ComponentLink2URL: https://jlcpcb.com/partdetail/C1739; Temperature Coefficient: X7R; Source: jlcpcb_capacitors_basic.schlib; ComponentLink3Description: LCSC Part URL; ComponentLink3URL: https://lcsc.com/product-detail/Multilayer-Ceramic-Capacitors-MLCC---SMD-SMT_FH-Guangdong-Fenghua-Advanced-Tech-FH-Guangdong-Fenghua-Advanced-Tech-0805B333K500NT_C1739.html; Tolerance: ±10%; RoHS: Yes; Package Size: 0805; Design Item ID: 0805B333K500NT; ComponentLink1Description: Datasheet; JLCPCB Basic Part: Yes; Manufacturer Part Number: 0805B333K500NT; Voltage Rating: 50V; ComponentLink1URL: https://datasheet.lcsc.com/lcsc/1811061723_FH--Guangdong-Fenghua-Advanced-Tech-0805B333K500NT_C1739.pdf; Category: Capacitors - MLCC; ComponentLink2Description: JLCPCB Part URL
C28 = CMP-00007-3: as C3 on sheet main; Manufacturer URL: http://www.samsungsem.com/global/index.jsp; Datasheet Version: Nov-10; Case Size/Dimension: 0402; Tolerance (%): ±10%; Datasheet URL: https://datasheet.ciiva.com/29198/458718-da-01-en-vs-kondensator-0402-29198423.pdf
U7 = CMP-0062-02174-2: Micropower 50 mA Ultra Low-Dropout Regulator, 5-pin SOT-23, Pb-Free; Manufacturer: National Semiconductor; PackageTopMarking: L01A*XTT; CompType: LDO IC; PowerWise: N; PackageVersion: revD, Aug-2008; ComponentLink3URL: http://www.national.com/packaging/folders/mf05a.html; ComponentLink2Description: LP2980 Web Page; ComponentLink3Description: MF05A Package Page; PackageDescription: Molded SOT-23, .115 x .063 x .040 in Body, 5 Lead, .0375 in Pitch; DatasheetVersion: Sep-2006; ComponentLink1Description: LP2980 Datasheet; PackageReference: MF05A; ComponentLink2URL: http://www.national.com/pf/LP/LP2980.html; RoHS: Y; PinCount: 5; ComponentLink1URL: http://www.national.com/ds/LP/LP2980.pdf; RevisionNote: Component URLs added
U8 = CMP-00001-4: 3.3V 1A LOW DROPOUT VOLTAGE REGULATOR SOT-223; Dropout voltage: 1.3 V; Output current: 1 A; Output voltage: 3.3 V
U9 = CMP-0244-00204-1: Positive Voltage Regulator, 12V, 3-Pin DPAK, Tape and Reel; PackageDescription: 3-Pin Transistor Outline Package 2.28 mm Pitch, 9.7 mm Lead Span (DPAK); PackageVersion: 2011; PackageReference: TO-252; ComponentLink2URL: http://www.st.com/internet/com/TECHNICAL_RESOURCES/TECHNICAL_LITERATURE/DATASHEET/CD00000447.pdf; ComponentLink2Description: Datasheet; ComponentLink1URL: http://www.st.com; ComponentLink1Description: Manufacturer URL; DatasheetVersion: 1/11/2010

## Sheet sensors_and_dpg_ports.SchDoc: Sensor Interfacing Components
size A4; DrawnBy: Quentin Boet; SheetNumber: 5; SheetTotal: 6
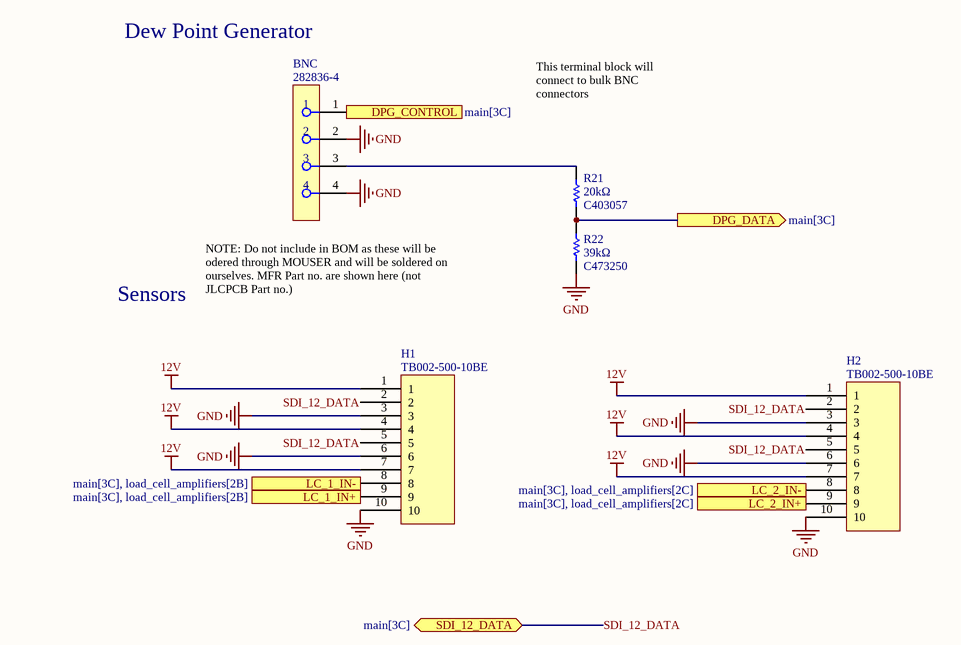
[diagram p5: sensors_and_dpg_ports.SchDoc]

### Parts
BNC  282836-4  [FP-282836-4-MFG]
H1  TB002-500-10BE  [TB002-500-10BE]
H2  TB002-500-10BE  [TB002-500-10BE]
R21  Resistance: 20kΩ  JLCPCB Part: C403057  [RESC1608X55X30ML15T15]  (hidden comment: ERJ-3EKF2002V)
R22  JLCPCB Part: C473250  Resistance: 39kΩ  [RESC1608X55X30LL20T20]  (hidden comment: ERA-3AEB393V)

### Ports
DPG_CONTROL (in, see main[3C]), DPG_DATA (out, see main[3C]), LC_1_IN+ (out, see main[3C], load_cell_amplifiers[2B]), LC_1_IN- (out, see main[3C], load_cell_amplifiers[2B]), LC_2_IN+ (out, see main[3C], load_cell_amplifiers[2C]), LC_2_IN- (out, see main[3C], load_cell_amplifiers[2C]), SDI_12_DATA (bidir, see main[3C])

### Nets
12V: H1.1 H1.4 H1.7 H2.1 H2.4 H2.7
GND: BNC.2 BNC.4 H1.3 H1.6 H1.10 H2.3 H2.6 H2.10 R22.1
DPG_CONTROL: BNC.1 ; port DPG_CONTROL
DPG_DATA: R21.1 R22.2 ; port DPG_DATA
LC_1_IN+: H1.9 ; port LC_1_IN+
LC_1_IN-: H1.8 ; port LC_1_IN-
LC_2_IN+: H2.9 ; port LC_2_IN+
LC_2_IN-: H2.8 ; port LC_2_IN-
SDI_12_DATA: H1.2 H1.5 H2.2 H2.5 ; port SDI_12_DATA
NetBNC_3: BNC.3 R21.2

### Notes on the sheet
- Dew Point Generator
- This terminal block will connect to bulk BNC connectors
- Sensors
- (near BNC) NOTE: Do not include in BOM as these will be odered through MOUSER and will be soldered on ourselves. MFR Part no. are shown here (not JLCPCB Part no.)
- Date:
- Sheet
- of
- Time:
- Revision:
- Drawn by:
- File:

### Library data of the parts
BNC = CMP-03790-46505329-1: 282836-4 Connector, Terminal Block; Wire Receptacle; 4 Pos.; 16-30 AWG; 0.197 in. CL; Sid; Manufacturer Lifecycle Status: ACTIVE; Number of Contacts: 4; Max Supply Voltage (AC): 300V; Wire Gauge (Min): 30AWG; Max Current Rating: 13.5A; Approvals: UL; Number of Levels: 1; Thread Size: M3; Connector System: Wire-to-Board; Voltage Rating (DC): 250V; Pitch: 5mm; Plating: Brass; Tail Length: 3.5mm; Housing Color: Green; Number of Rows: 1; REACH SVHC: Unknown; Lead Pitch: 5mm; Depth: 8.2mm; Lead Free: Lead Free; Mount: Through Hole; Contact Plating: Tin; Housing Material: Polyamide; ELV: Compliant; Radiation Hardening: No; RoHS: Compliant; Number of Circuits: 4; Voltage Rating: 300V; Contact Material: Brass; NexarPartId: 46505329; Current Rating: 13.5A; Max Voltage Rating (AC): 300V; Orientation: Straight; Number of Positions: 4; Lifecycle Status: Production; Operating Supply Voltage: 300V; Connector Type: Receptacle; Number of Positions Per Level: 4; Flammability Rating: UL94 V-0; Packaging: Bulk; Termination: Screw, Solder; Wire Gauge (Max): 30AWG; Number of Poles: 4; Width: 10mm; Voltage Rating (AC): 250V; Length: 20mm; Current: 13.5A; Voltage: 300V; Color: Green; JLCPCB Part: jlcpcb part no.
H1 H2 = TB002-500-10BE-1: 2~24 Poles, Screw Type, Horizontal, 5.0 Pitch, 22~12 (AWG), Terminal Block Connector; Number of Positions Per Level: 10; Plating: Steel; Pitch: 5mm; Min Operating Temperature: -40°C; Width: 7.6mm; Contact Plating: Tin; Orientation: Horizontal; Height: 10mm; Max Operating Temperature: 105°C; Mounting Technology: Through Hole; JLCPCB Part: jlcpcb part no.
R21 = CMP-2000-00318-1: Manufacturer: Panasonic; Part Number: ERJ-3EKF2002V
R22 = CMP-2000-00055-1: Manufacturer: Panasonic; Part Number: ERA-3AEB393V

## Nets that join several sheets
3V3: main (23 pins), sd_card (7 pins), tranciever (R9.2 R10.2 R11.2), power_supply (C17.1 U8.2 U8.4)
5V: main (C10.2 C11.1 DAC.3), tranciever (C5.2 R12.2 U6.8), power_supply (C15.1 C16.1 U7.5 U8.3)
12V: load_cell_amplifiers (C33.2 C34.2 U4.8 U5.8), power_supply (C28.2 U9.3), sensors_and_dpg_ports (6 pins)
GND: main (38 pins), sd_card (5 pins), load_cell_amplifiers (8 pins), tranciever (5 pins), power_supply (10 pins), sensors_and_dpg_ports (9 pins)
DPG_CONTROL: main (C9.2 DAC.1), sensors_and_dpg_ports (BNC.1)
DPG_DATA: main (U1.38), sensors_and_dpg_ports (R21.1 R22.2)
ENABLE_DRIVE: main (U1.18), tranciever (R9.1 R10.1 U6.2 U6.3)
LC_1_IN+: load_cell_amplifiers (U4.4), sensors_and_dpg_ports (H1.9)
LC_1_IN-: load_cell_amplifiers (U4.1), sensors_and_dpg_ports (H1.8)
LC_1_OUT: main (U1.39), load_cell_amplifiers (D1.1 U4.7)
LC_2_IN+: load_cell_amplifiers (U5.4), sensors_and_dpg_ports (H2.9)
LC_2_IN-: load_cell_amplifiers (U5.1), sensors_and_dpg_ports (H2.8)
LC_2_OUT: main (U1.40), load_cell_amplifiers (D2.1 U5.7)
SD_CLK: main (U1.29), sd_card (R18.1 SD_CARD.5)
SD_CS: main (U1.28), sd_card (R16.1 SD_CARD.2)
SD_MISO: main (U1.27), sd_card (R19.1 SD_CARD.7)
SD_MOSI: main (U1.30), sd_card (R17.1 SD_CARD.3)
SDI_12_DATA: tranciever (R20.2 U6.7), sensors_and_dpg_ports (H1.2 H1.5 H2.2 H2.5)
SDI_12_UART1_RX: main (U1.12), tranciever (R14.2 R15.1)
SDI_12_UART1_TX: main (U1.11), tranciever (R11.1 U6.4)